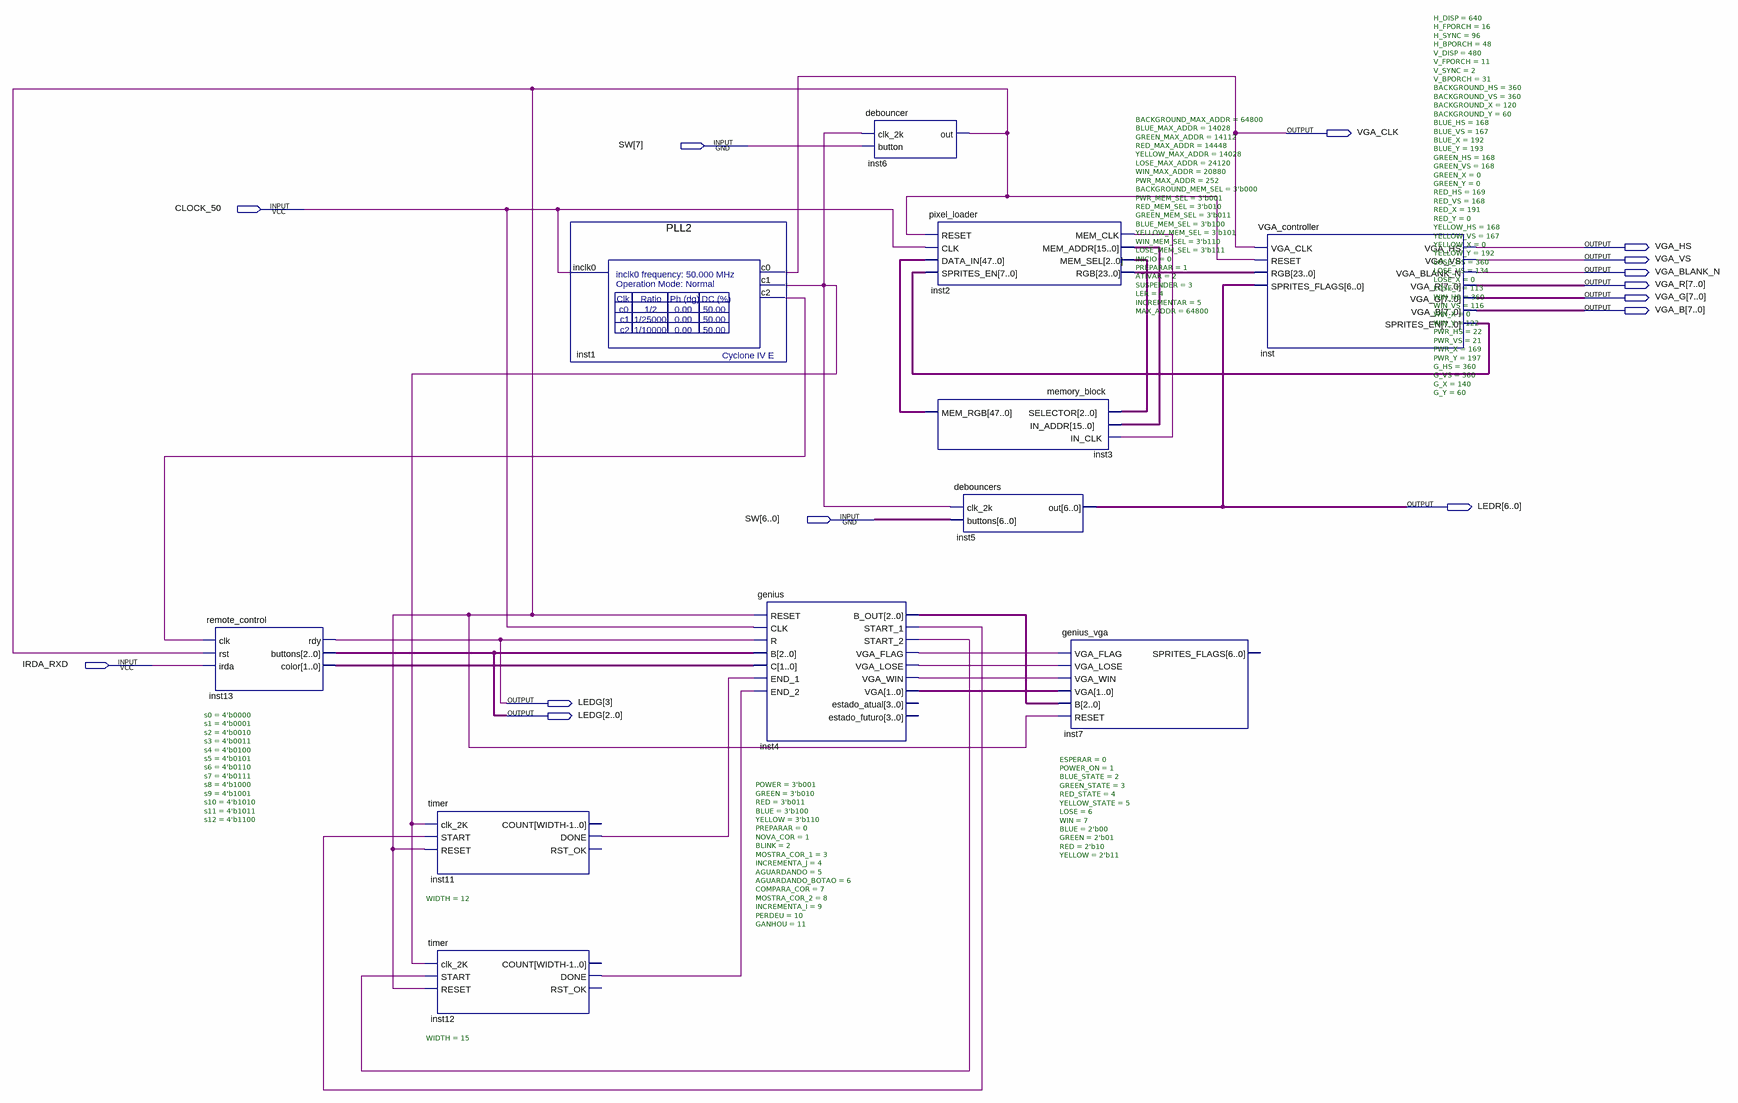
[diagram p0: schematic sheet]
// Quartus schematic Genius_top_level.bdf as structural Verilog: 11 symbols, 14 pins
module Genius_top_level (
  input  [7:0] SW,
  input  CLOCK_50,
  input  IRDA_RXD,
  output VGA_CLK,
  output VGA_HS,
  output VGA_VS,
  output VGA_BLANK_N,
  output [7:0] VGA_R,
  output [7:0] VGA_G,
  output [7:0] VGA_B,
  output [6:0] LEDR,
  output [3:0] LEDG
);

  wire inst1_c1, inst1_c2, inst2_mem_clk, inst4_start_1, inst4_start_2, inst4_vga_flag, inst4_vga_lose,
       inst4_vga_win, inst6_out, inst11_done, inst12_done;
  wire [1:0] inst4_vga, inst13_color;
  wire [2:0] inst2_mem_sel, inst4_b_out;
  wire [7:0] inst_sprites_en;
  wire [15:0] inst2_mem_addr;
  wire [23:0] inst2_rgb;
  wire [47:0] inst3_mem_rgb;

  remote_control #(.s0(4'b0000), .s1(4'b0001), .s2(4'b0010), .s3(4'b0011), .s4(4'b0100), .s5(4'b0101), .s6(4'b0110), .s7(4'b0111), .s8(4'b1000), .s9(4'b1001), .s10(4'b1010), .s11(4'b1011), .s12(4'b1100)) inst13 (
    .clk(inst1_c2), .rst(inst6_out), .irda(IRDA_RXD), .rdy(LEDG[3]), .buttons(LEDG[2:0]), .color(inst13_color));
  timer #(.WIDTH(12)) inst11 (
    .clk_2K(inst1_c1), .START(inst4_start_1), .RESET(inst6_out), .DONE(inst11_done));  // open: COUNT, RST_OK
  timer #(.WIDTH(15)) inst12 (
    .clk_2K(inst1_c1), .START(inst4_start_2), .RESET(inst6_out), .DONE(inst12_done));  // open: COUNT, RST_OK
  PLL2 inst1 (.inclk0(CLOCK_50), .c0(VGA_CLK), .c1(inst1_c1), .c2(inst1_c2));
  genius #(.POWER(3'b001), .GREEN(3'b010), .RED(3'b011), .BLUE(3'b100), .YELLOW(3'b110), .PREPARAR(0), .NOVA_COR(1), .BLINK(2), .MOSTRA_COR_1(3), .INCREMENTA_J(4), .AGUARDANDO(5), .AGUARDANDO_BOTAO(6), .COMPARA_COR(7), .MOSTRA_COR_2(8), .INCREMENTA_I(9), .PERDEU(10), .GANHOU(11)) inst4 (
    .RESET(inst6_out), .CLK(CLOCK_50), .R(LEDG[3]), .B(LEDG[2:0]), .C(inst13_color), .END_1(inst11_done),
    .END_2(inst12_done), .B_OUT(inst4_b_out), .START_1(inst4_start_1), .START_2(inst4_start_2),
    .VGA_FLAG(inst4_vga_flag), .VGA_LOSE(inst4_vga_lose), .VGA_WIN(inst4_vga_win), .VGA(inst4_vga));  // open: estado_atual, estado_futuro
  debouncer inst6 (.clk_2k(inst1_c1), .button(SW[7]), .out(inst6_out));
  pixel_loader #(.BACKGROUND_MAX_ADDR(64800), .BLUE_MAX_ADDR(14028), .GREEN_MAX_ADDR(14112), .RED_MAX_ADDR(14448), .YELLOW_MAX_ADDR(14028), .LOSE_MAX_ADDR(24120), .WIN_MAX_ADDR(20880), .PWR_MAX_ADDR(252), .BACKGROUND_MEM_SEL(3'b000), .PWR_MEM_SEL(3'b001), .RED_MEM_SEL(3'b010), .GREEN_MEM_SEL(3'b011), .BLUE_MEM_SEL(3'b100), .YELLOW_MEM_SEL(3'b101), .WIN_MEM_SEL(3'b110), .LOSE_MEM_SEL(3'b111), .INICIO(0), .PREPARAR(1), .ATIVAR(2), .SUSPENDER(3), .LER(4), .INCREMENTAR(5), .MAX_ADDR(64800)) inst2 (
    .RESET(inst6_out), .CLK(CLOCK_50), .DATA_IN(inst3_mem_rgb), .SPRITES_EN(inst_sprites_en),
    .MEM_CLK(inst2_mem_clk), .MEM_ADDR(inst2_mem_addr), .MEM_SEL(inst2_mem_sel), .RGB(inst2_rgb));
  memory_block inst3 (
    .SELECTOR(inst2_mem_sel), .IN_ADDR(inst2_mem_addr), .IN_CLK(inst2_mem_clk), .MEM_RGB(inst3_mem_rgb));
  debouncers inst5 (.clk_2k(inst1_c1), .buttons(SW[6:0]), .out(LEDR));
  genius_vga #(.ESPERAR(0), .POWER_ON(1), .BLUE_STATE(2), .GREEN_STATE(3), .RED_STATE(4), .YELLOW_STATE(5), .LOSE(6), .WIN(7), .BLUE(2'b00), .GREEN(2'b01), .RED(2'b10), .YELLOW(2'b11)) inst7 (
    .VGA_FLAG(inst4_vga_flag), .VGA_LOSE(inst4_vga_lose), .VGA_WIN(inst4_vga_win), .VGA(inst4_vga),
    .B(inst4_b_out), .RESET(inst6_out));  // open: SPRITES_FLAGS
  VGA_controller #(.H_DISP(640), .H_FPORCH(16), .H_SYNC(96), .H_BPORCH(48), .V_DISP(480), .V_FPORCH(11), .V_SYNC(2), .V_BPORCH(31), .BACKGROUND_HS(360), .BACKGROUND_VS(360), .BACKGROUND_X(120), .BACKGROUND_Y(60), .BLUE_HS(168), .BLUE_VS(167), .BLUE_X(192), .BLUE_Y(193), .GREEN_HS(168), .GREEN_VS(168), .GREEN_X(0), .GREEN_Y(0), .RED_HS(169), .RED_VS(168), .RED_X(191), .RED_Y(0), .YELLOW_HS(168), .YELLOW_VS(167), .YELLOW_X(0), .YELLOW_Y(192), .LOSE_HS(360), .LOSE_VS(134), .LOSE_X(0), .LOSE_Y(113), .WIN_HS(360), .WIN_VS(116), .WIN_X(0), .WIN_Y(122), .PWR_HS(22), .PWR_VS(21), .PWR_X(169), .PWR_Y(197), .G_HS(360), .G_VS(360), .G_X(140), .G_Y(60)) inst (
    .VGA_CLK(VGA_CLK), .RESET(inst6_out), .RGB(inst2_rgb), .SPRITES_FLAGS(LEDR), .VGA_HS(VGA_HS),
    .VGA_VS(VGA_VS), .VGA_BLANK_N(VGA_BLANK_N), .VGA_R(VGA_R), .VGA_G(VGA_G), .VGA_B(VGA_B),
    .SPRITES_EN(inst_sprites_en));
endmodule
